# EAGLE design so28 (EAGLE 7.6.0)
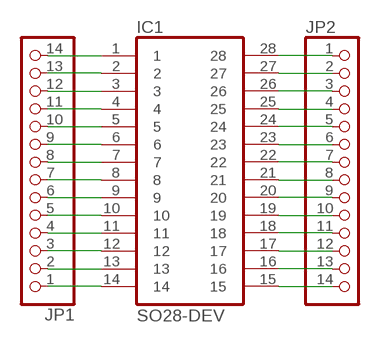
[diagram p0: schematic, sheet 1]

## Parts
IC1  SO28-DEV  [SO28W]
JP1  PINHD-1X14  [1X14]
JP2  PINHD-1X14  [1X14]

## Nets
N$1: IC1.1 JP1.14
N$2: IC1.2 JP1.13
N$3: IC1.3 JP1.12
N$4: IC1.4 JP1.11
N$5: IC1.5 JP1.10
N$6: IC1.6 JP1.9
N$7: IC1.7 JP1.8
N$8: IC1.8 JP1.7
N$9: IC1.9 JP1.6
N$10: IC1.10 JP1.5
N$11: IC1.11 JP1.4
N$12: IC1.12 JP1.3
N$13: IC1.13 JP1.2
N$14: IC1.14 JP1.1
N$15: IC1.15 JP2.14
N$16: IC1.16 JP2.13
N$17: IC1.17 JP2.12
N$18: IC1.18 JP2.11
N$19: IC1.19 JP2.10
N$20: IC1.20 JP2.9
N$21: IC1.21 JP2.8
N$22: IC1.22 JP2.7
N$23: IC1.23 JP2.6
N$24: IC1.24 JP2.5
N$25: IC1.25 JP2.4
N$26: IC1.26 JP2.3
N$27: IC1.27 JP2.2
N$28: IC1.28 JP2.1

## Library data of the parts
IC1 = packages:SO28-DEV
JP1 JP2 = pinhead:PINHD-1X14: PIN HEADER

## Board
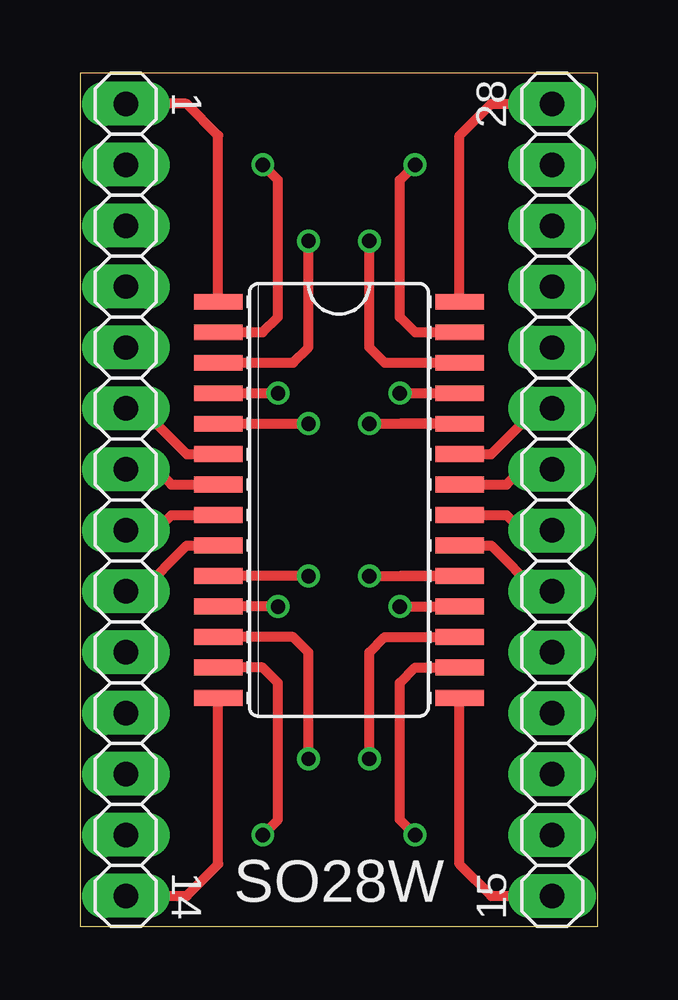
[diagram p1: board, top side]
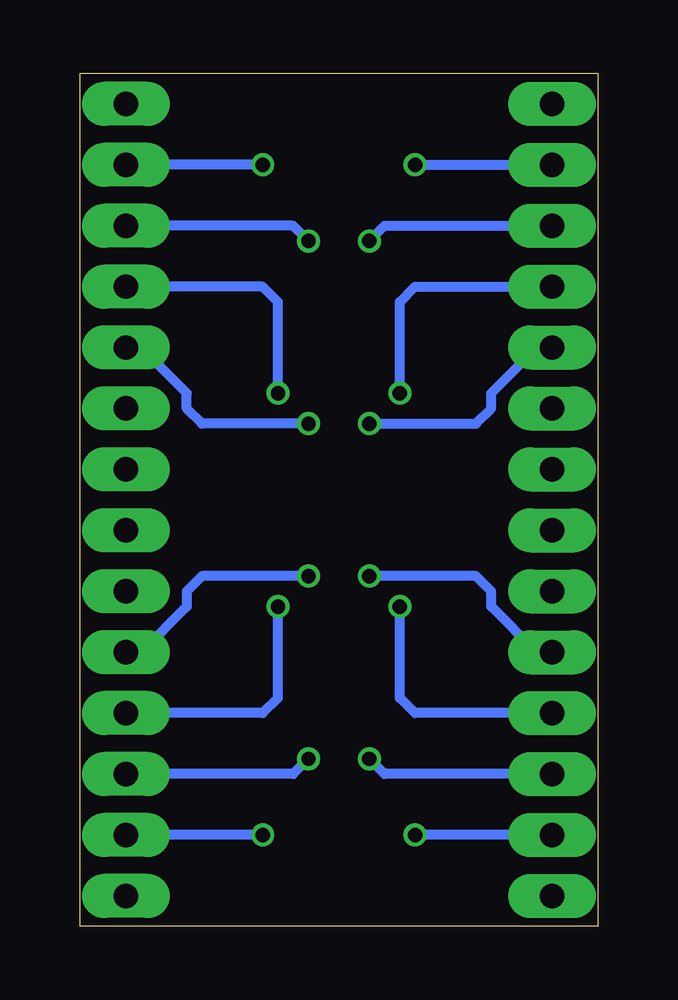
[diagram p2: board, bottom side, seen from below]

Size 21.59 x 35.56 mm. Coordinates in mm from the lower left corner, seen from the top.
Outline: 0,0 21.59,0 21.59,35.56 0,35.56 0,0
Copper layers (1*16): Top 0.0356mm / dielectric 1.5011mm / Bottom 0.0356mm
Design rules "Saintgimp-OSHPark": minimum track width 10mil, minimum drill 13mil, track to track 6mil, track to pad 6mil, pad to pad 6mil, via to via 6mil, smd to smd 6mil, copper to edge 15mil, drill to drill 6mil, minimum pad ring 12mil, minimum via ring 7mil, stop-mask expansion 2mil, vias tented up to drill 24mil, thermal gap 10mil

### Footprints (pad centres in the part's own frame; a part is rotated, then mirrored left to right if it is on the bottom)
SO28W = smd 0.66 x 2.032: 1 -8.255,-5.029; 2 -6.985,-5.029; 3 -5.715,-5.029; 4 -4.445,-5.029; 5 -3.175,-5.029; 6 -1.905,-5.029; 7 -0.635,-5.029; 8 0.635,-5.029; 9 1.905,-5.029; 10 3.175,-5.029; 11 4.445,-5.029; 12 5.715,-5.029; 13 6.985,-5.029; 14 8.255,-5.029; 15 8.255,5.029; 16 6.985,5.029; 17 5.715,5.029; 18 4.445,5.029; 19 3.175,5.029; 20 1.905,5.029; 21 0.635,5.029; 22 -0.635,5.029; 23 -1.905,5.029; 24 -3.175,5.029; 25 -4.445,5.029; 26 -5.715,5.029; 27 -6.985,5.029; 28 -8.255,5.029
1X14 = drill 1.016 long: 1 -16.51,0; 2 -13.97,0; 3 -11.43,0; 4 -8.89,0; 5 -6.35,0; 6 -3.81,0; 7 -1.27,0; 8 1.27,0; 9 3.81,0; 10 6.35,0; 11 8.89,0; 12 11.43,0; 13 13.97,0; 14 16.51,0

### Placement (x,y rotation side)
IC1  10.79,17.78 270 top
JP1  1.91,17.78 90 top
JP2  19.68,17.78 270 top

### Tracks (layer width: path | path; a pad name or v marks a point on that pad's centre or on a via)
N$1
  Top 0.406: IC1.1 5.77,32.97 4.45,34.29 JP1.14
N$2  (via drill 0.6)
  Top 0.406: IC1.2 7.62,24.77 8.26,25.4 8.26,31.11 v7.62,31.75
  Bottom 0.406: v7.62,31.75 JP1.13
N$3  (via drill 0.6)
  Top 0.406: IC1.3 8.89,23.5 9.53,24.13 v9.53,28.57
  Bottom 0.406: v9.53,28.57 8.89,29.21 JP1.12
N$4  (via drill 0.6)
  Top 0.406: IC1.4 v8.26,22.23
  Bottom 0.406: v8.26,22.23 8.26,26.04 7.62,26.67 JP1.11
N$5  (via drill 0.6)
  Top 0.406: 8.26,20.95 IC1.5 v9.53,20.95
  Bottom 0.406: v9.53,20.95 5.08,20.95 4.45,21.59 4.45,22.23 2.54,24.13 JP1.10
N$6
  Top 0.406: IC1.6 4.45,19.68 2.54,21.59 JP1.9
N$7
  Top 0.406: IC1.7 3.81,18.41 3.17,19.05 JP1.8
N$8
  Top 0.406: IC1.8 3.81,17.14 3.17,16.51 JP1.7
N$9
  Top 0.406: IC1.9 4.45,15.88 2.54,13.97 JP1.6
N$10  (via drill 0.6)
  Top 0.406: v9.53,14.61 IC1.10
  Bottom 0.406: v9.53,14.61 5.08,14.61 4.45,13.97 4.45,13.34 2.54,11.43 JP1.5
N$11  (via drill 0.6)
  Top 0.406: v8.26,13.34 IC1.11
  Bottom 0.406: v8.26,13.34 8.26,9.53 7.62,8.89 JP1.4
N$12  (via drill 0.6)
  Top 0.406: IC1.12 8.89,12.06 9.53,11.43 v9.53,6.99
  Bottom 0.406: v9.53,6.99 8.89,6.35 JP1.3
N$13  (via drill 0.6)
  Top 0.406: IC1.13 7.62,10.79 8.26,10.16 8.26,4.45 v7.62,3.81
  Bottom 0.406: JP1.2 v7.62,3.81
N$14
  Top 0.406: IC1.14 5.77,2.59 4.45,1.27 JP1.1
N$15
  Top 0.406: IC1.15 15.82,2.59 17.14,1.27 JP2.14
N$16  (via drill 0.6)
  Top 0.406: IC1.16 13.97,10.79 13.34,10.16 13.34,4.45 v13.97,3.81
  Bottom 0.406: v13.97,3.81 JP2.13
N$17  (via drill 0.6)
  Top 0.406: 15.88,12.06 IC1.17 12.7,12.06 12.06,11.43 v12.06,6.99
  Bottom 0.406: v12.06,6.99 12.7,6.35 JP2.12
N$18  (via drill 0.6)
  Top 0.406: v13.34,13.34 IC1.18
  Bottom 0.406: v13.34,13.34 13.34,9.53 13.97,8.89 JP2.11
N$19  (via drill 0.6)
  Top 0.406: 13.34,14.61 IC1.19 v12.06,14.61
  Bottom 0.406: v12.06,14.61 16.51,14.61 17.14,13.97 17.14,13.34 19.05,11.43 JP2.10
N$20
  Top 0.406: IC1.20 17.14,15.88 19.05,13.97 JP2.9
N$21
  Top 0.406: IC1.21 17.78,17.14 18.41,16.51 JP2.8
N$22
  Top 0.406: IC1.22 17.78,18.41 18.41,19.05 JP2.7
N$23
  Top 0.406: IC1.23 17.14,19.68 19.05,21.59 JP2.6
N$24  (via drill 0.6)
  Top 0.406: IC1.24 16.51,20.95 | IC1.24 13.34,20.95 | v12.06,20.95 IC1.24
  Bottom 0.406: v12.06,20.95 16.51,20.95 17.14,21.59 17.14,22.23 19.05,24.13 JP2.5
N$25  (via drill 0.6)
  Top 0.406: v13.34,22.23 IC1.25
  Bottom 0.406: v13.34,22.23 13.34,26.04 13.97,26.67 JP2.4
N$26  (via drill 0.6)
  Top 0.406: IC1.26 12.7,23.5 12.06,24.13 v12.06,28.57
  Bottom 0.406: v12.06,28.57 12.7,29.21 JP2.3
N$27  (via drill 0.6)
  Top 0.406: IC1.27 13.97,24.77 13.34,25.4 13.34,31.11 v13.97,31.75
  Bottom 0.406: v13.97,31.75 JP2.2
N$28
  Top 0.406: IC1.28 15.82,32.97 17.14,34.29 JP2.1

### Text on the board
tPlace: 1 | 28 | SO28W | 14 | 15